# EAGLE design luxeon_r5_smd_sense_res_only (EAGLE 5.08)
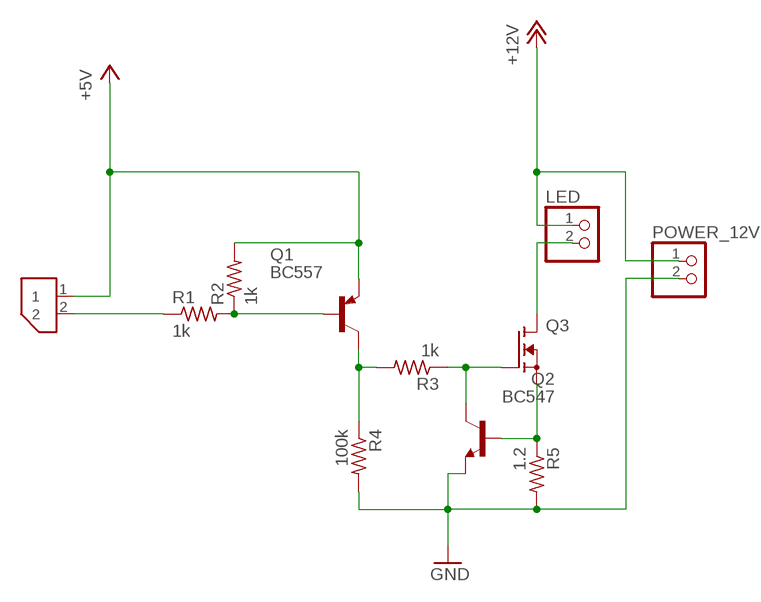
[diagram p0: schematic, sheet 1]

## Parts
LED  PINHD-1X2  [1X02]
POWER_12V  PINHD-1X2  [1X02]
Q1  BC557  [TO92]
Q2  BC547  [TO92]
Q3  TOSHIBA-2SK4033  [TO252]
R1  1k  R-US_0207/7  [0207/7]
R2  1k  R-US_0207/7  [0207/7]
R3  1k  R-US_0207/7  [0207/7]
R4  100k  R-US_0207/7  [0207/7]
R5  1.2  R-US_R2512  [R2512]
TO_SLAVE  MOLEX-SPOX-HEADER-2-RA  [SPOX-WTB-HEADER-2-RA]

## Nets
+5V: Q1.1(E) R2.2 TO_SLAVE.1
+12V: LED.1 POWER_12V.1
DISSIPATE: LED.2 Q3.3(D)
GND: POWER_12V.2 Q2.1(E) R4.2 R5.2
N$1: Q1.2(B) R1.2 R2.1
N$2: Q2.3(C) Q3.1(G) R3.1
N$3: Q1.3(C) R3.2 R4.1
N$4: Q2.2(B) Q3.2(S) R5.1
SLV: R1.1 TO_SLAVE.2

## Library data of the parts
LED POWER_12V = pinhead:PINHD-1X2: PIN HEADER
Q1 = transistor-pnp:BC557: PNP Transistor
Q2 = transistor:BC547: NPN TRANSISTOR
Q3 = damians_bits:TOSHIBA-2SK4033: TOSHIBA 2SK4033 Field Effect Transistor N-Channel MOSFET
R1-R5 = resistor:R-US_: RESISTOR, American symbol
TO_SLAVE = damians_bits:MOLEX-SPOX-HEADER-2-RA: Molex SPOX 22-05-7025 WTB Header, Right-angle, 2 way

## Board
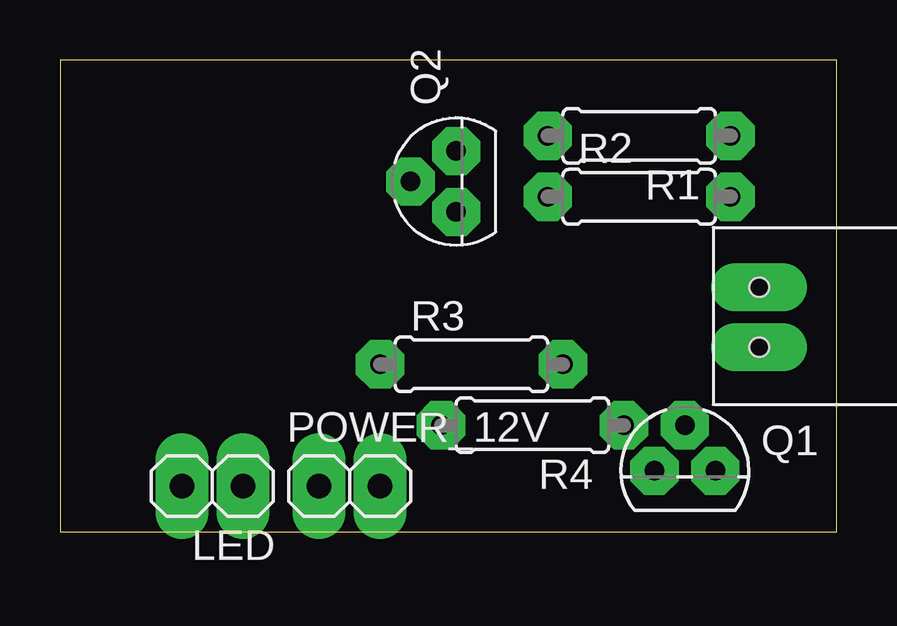
[diagram p1: board, top side]
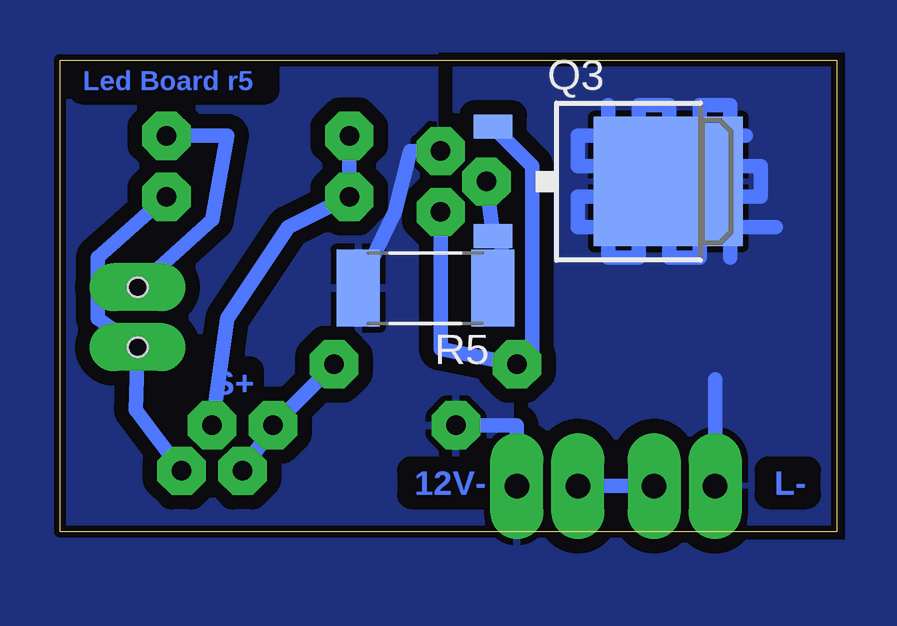
[diagram p2: board, bottom side, seen from below]

Size 32.37 x 19.68 mm. Coordinates in mm from the lower left corner, seen from the top.
Outline: 0,0 32.37,0 32.37,19.68 0,19.68 0,0
Copper layers (1*16): Top 0.035mm / dielectric 1.5mm / Bottom 0.035mm
Design rules "default *": minimum track width 0.6mm, minimum drill 0.8mm, track to track 0.6mm, track to pad 0.6mm, pad to pad 0.45mm, via to via 0.6mm, smd to smd 8mil, copper to edge 10mil, drill to drill 8mil, minimum pad ring 0.6mm, minimum via ring 0.6mm, stop-mask expansion 0mil, vias tented up to drill 0mil, thermal gap 10mil

### Footprints (pad centres in the part's own frame; a part is rotated, then mirrored left to right if it is on the bottom)
1X02 = drill 1.016 long: 1 -1.27,0; 2 1.27,0
TO92 = drill 0.813 octagon: 1 1.27,0; 2 0,1.905; 3 -1.27,0
TO252 = smd 1 x 1.6: 1 -2.28,-4.8; 2 2.28,-4.8 | smd 5.4 x 6.2: 3 0,2.5
0207/7 = drill 0.813 octagon: 1 -3.81,0; 2 3.81,0
R2512 = smd 1.8 x 3.2: 1 -2.8,0; 2 2.8,0
SPOX-WTB-HEADER-2-RA = drill 0.8 long: 1 1.19,0.56; 2 -1.31,0.56 | hole 0.8: -1.31,0.56; 1.19,0.56

### Placement (x,y rotation side)
LED  6.35,1.91 180 top
POWER_12V  12.06,1.91 0 top
Q1  26.04,2.54 0 top
Q2  16.51,14.61 90 top
Q3  9.53,14.61 270 bottom
R1  24.13,16.51 180 top
R2  24.13,13.97 0 top
R3  17.14,6.99 0 top
R4  19.68,4.45 180 top
R5  17.14,10.16 180 bottom
TO_SLAVE  28.57,8.89 270 top

### Tracks (layer width: path | path; a pad name or v marks a point on that pad's centre or on a via)
+5V
  Bottom 0.61: R2.2 30.8,11.43 30.8,8.89 TO_SLAVE.1 29.21,5.08 Q1.1
+12V
  Bottom 0.6: LED.1 POWER_12V.1
DISSIPATE
  Bottom 0.61: 3.81,16.51 10.79,16.51 10.79,15.24 3.17,15.24 3.17,13.97 10.79,13.97 10.79,12.7 2.54,12.7 | 4.45,11.43 4.45,17.78 5.71,17.78 5.71,11.43 6.99,11.43 6.99,17.78 8.26,17.78 8.26,11.43 9.53,11.43 9.53,17.78 | LED.2 5.08,6.35
  pour Bottom (isolate 0.254): 15.88,19.68 0,19.68 0,0 13.34,0 13.34,7.62 15.88,10.16
GND
  Bottom 0.61: Q2.1 17.78,15.88 18.41,13.34 R5.2 | POWER_12V.2 13.34,4.45 R4.2
  pour Bottom (rank 2): -5.08,26.67 -5.08,-3.81 35.56,-3.81 35.56,26.67
N$1
  Bottom 0.6: R2.1 R1.2
  Bottom 0.61: R2.1 22.86,12.7 25.4,8.89 Q1.2
N$2
  Bottom 0.6: Q3.1 13.97,16.51 12.7,15.24 12.7,6.99 R3.1
  Bottom 0.61: R3.1 16.51,7.62 Q2.3
N$3
  Bottom 0.6: R3.2 R4.1 Q1.3
N$4
  Bottom 0.6: R5.1 13.97,10.16 13.97,12.06 Q3.2
  Bottom 0.61: Q3.2 Q2.2
SLV
  Bottom 0.61: TO_SLAVE.2 26.04,13.02 25.4,16.51 R1.1

### Text on the board
Bottom: Led Board r5 | S+ | L- | 12V-